# EAGLE design B12356-04b (EAGLE 6.6.0)
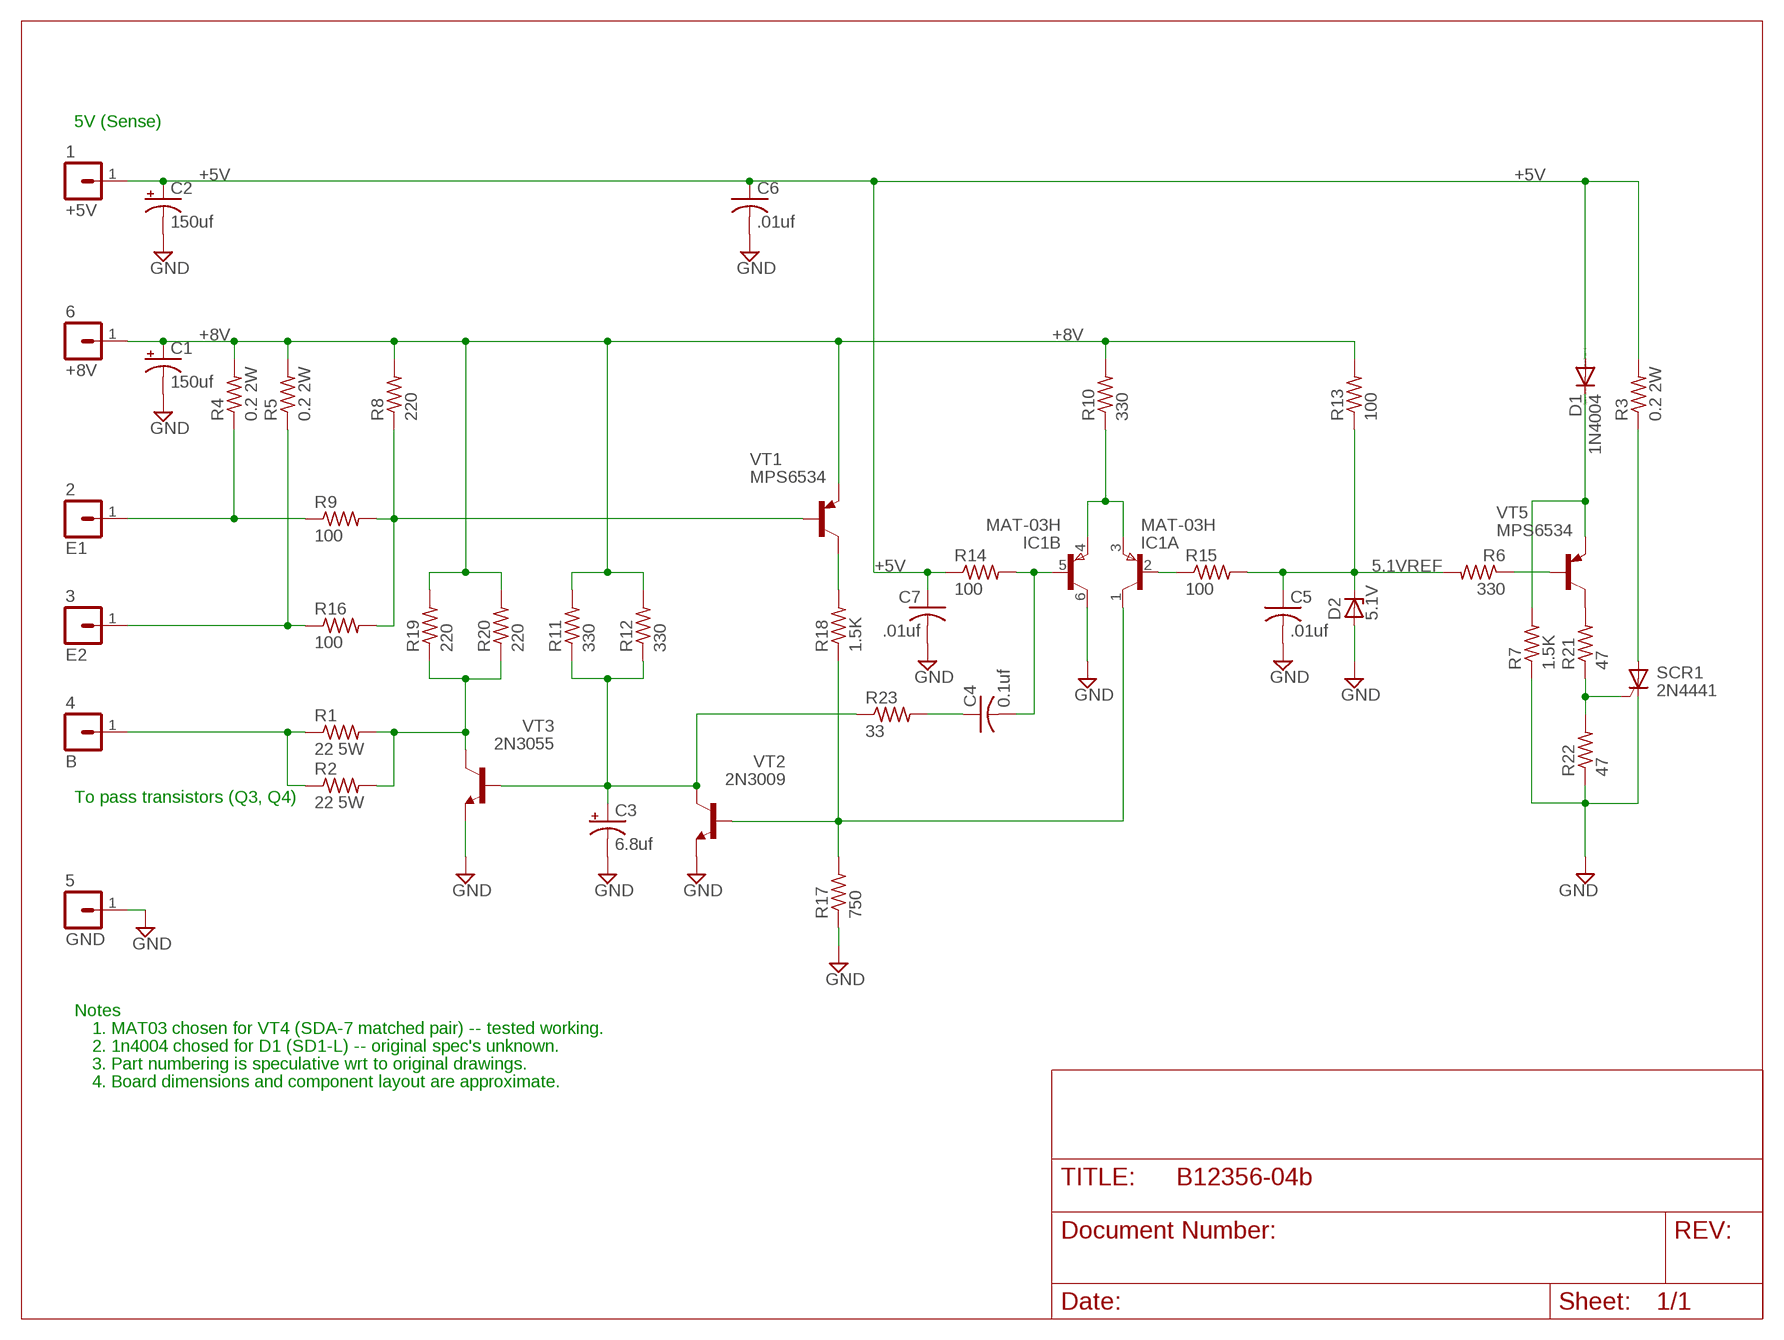
[diagram p0: schematic, sheet 1]

## Parts
+5V  1  LUG  [SPADELUG]
+8V  6  LUG  [SPADELUG]
B  4  LUG  [SPADELUG]
C1  150uf  CPOL-USE30-10AXIAL  [E30-10]
C2  150uf  CPOL-USE25-9AXIAL  [E25-9]
C3  6.8uf  CPOL-USE22-6AXIAL  [E22-6]
C4  0.1uf  C-US150-054X183  [C150-054X183]
C5  .01uf  C-US050-025X075  [C050-025X075]
C6  .01uf  C-US050-025X075  [C050-025X075]
C7  .01uf  C-US050-025X075  [C050-025X075]
D1  1N4004  [DO41-10]
D2  5.1V  ZENER-DIODEF126-12  [F126Z12]
E1  2  LUG  [SPADELUG]
E2  3  LUG  [SPADELUG]
GND  5  LUG  [SPADELUG]
IC1  MAT-03H  [TO78]
R1  22 5W  R-US_0817/22  [P0817/22]
R2  22 5W  R-US_0817/22  [P0817/22]
R3  0.2 2W  R-US_0617/22  [0617/22]
R4  0.2 2W  R-US_0617/22  [0617/22]
R5  0.2 2W  R-US_0617/22  [0617/22]
R6  330  R-US_0207/12  [0207/12]
R7  1.5K  R-US_0207/12  [0207/12]
R8  220  R-US_0207/12  [0207/12]
R9  100  R-US_0207/12  [0207/12]
R10  330  R-US_0207/12  [0207/12]
R11  330  R-US_0207/12  [0207/12]
R12  330  R-US_0207/12  [0207/12]
R13  100  R-US_0207/12  [0207/12]
R14  100  R-US_0207/12  [0207/12]
R15  100  R-US_0207/12  [0207/12]
R16  100  R-US_0207/12  [0207/12]
R17  750  R-US_0207/10  [0207/10]
R18  1.5K  R-US_0207/10  [0207/10]
R19  220  R-US_0207/12  [0207/12]
R20  220  R-US_0207/12  [0207/12]
R21  47  R-US_0207/12  [0207/12]
R22  47  R-US_0207/12  [0207/12]
R23  33  R-US_0207/12  [0207/12]
SCR1  2N4441  BT151  [TO220CL]
VT1  MPS6534  MPSA56-PNP-TO92-BCE  [TO92-BCE]
VT2  2N3009  2N2222  [TO18]
VT3  2N3055  [TO3]
VT5  MPS6534  MPSA56-PNP-TO92-BCE  [TO92-BCE]

## Nets
5.1VREF: C5.1 D2.C R6.2 R13.1 R15.2
+5V: +5V.1 C2.+ C6.1 C7.1 D1.A R3.2 R14.1
+8V: +8V.1 C1.+ R4.2 R5.2 R8.2 R10.2 R11.2 R12.2 R13.2 R19.2 R20.2 VT1.E
GND: C1.- C2.- C3.- C5.2 C6.2 C7.2 D2.A GND.1 IC1.6(B:C) R7.1 R17.1 R22.1 SCR1.C VT2.1(E) VT3.E
N$1: IC1.2(A:B) R15.1
N$2: IC1.3(A:E) IC1.4(B:E) R10.1
N$3: R3.1 SCR1.A
N$4: R21.1 R22.2 SCR1.G
N$5: E1.1 R4.1 R9.1
N$6: E2.1 R5.1 R16.1
N$7: R8.1 R9.2 R16.2 VT1.B
N$8: R21.2 VT5.C
N$9: D1.C R7.2 VT5.E
N$10: R6.1 VT5.B
N$11: IC1.1(A:C) R17.2 R18.1 VT2.2(B)
N$12: B.1 R1.1 R2.1
N$13: R18.2 VT1.C
N$14: C3.+ R11.1 R12.1 R23.1 VT2.3(C) VT3.B
N$16: R1.2 R2.2 R19.1 R20.1 VT3.C VT3.C/(C)
N$18: C4.2 IC1.5(B:B) R14.2
N$19: C4.1 R23.2

## Notes on the sheet
- 5V (Sense)
- To pass transistors (Q3, Q4)
- Notes
- 1. MAT03 chosen for VT4 (SDA-7 matched pair) -- tested working.
- 2. 1n4004 chosed for D1 (SD1-L) -- original spec's unknown.
- 3. Part numbering is speculative wrt to original drawings.
- 4. Board dimensions and component layout are approximate.

## Library data of the parts
+5V +8V B E1 E2 GND = dec-con:LUG: Spade Lug
C1-C3 = rcl:CPOL-US: POLARIZED CAPACITOR, American symbol
C4-C7 = rcl:C-US: CAPACITOR, American symbol
D1 = diode:1N4004: DIODE general purpose rectifier, 1 A
D2 = diode:ZENER-DIODE: Z-Diode
IC1 = linear:MAT-03H: Dual TRANSISTOR
R1-R23 = rcl:R-US_: RESISTOR, American symbol
SCR1 = triac:BT151: THYRISTOR
VT1 VT5 = transistor:*-PNP-: PNP Transistror
VT2 = transistor:2N2222: NPN TRANSISTOR
VT3 = transistor-npn:2N3055: NPN Transistor

## Board
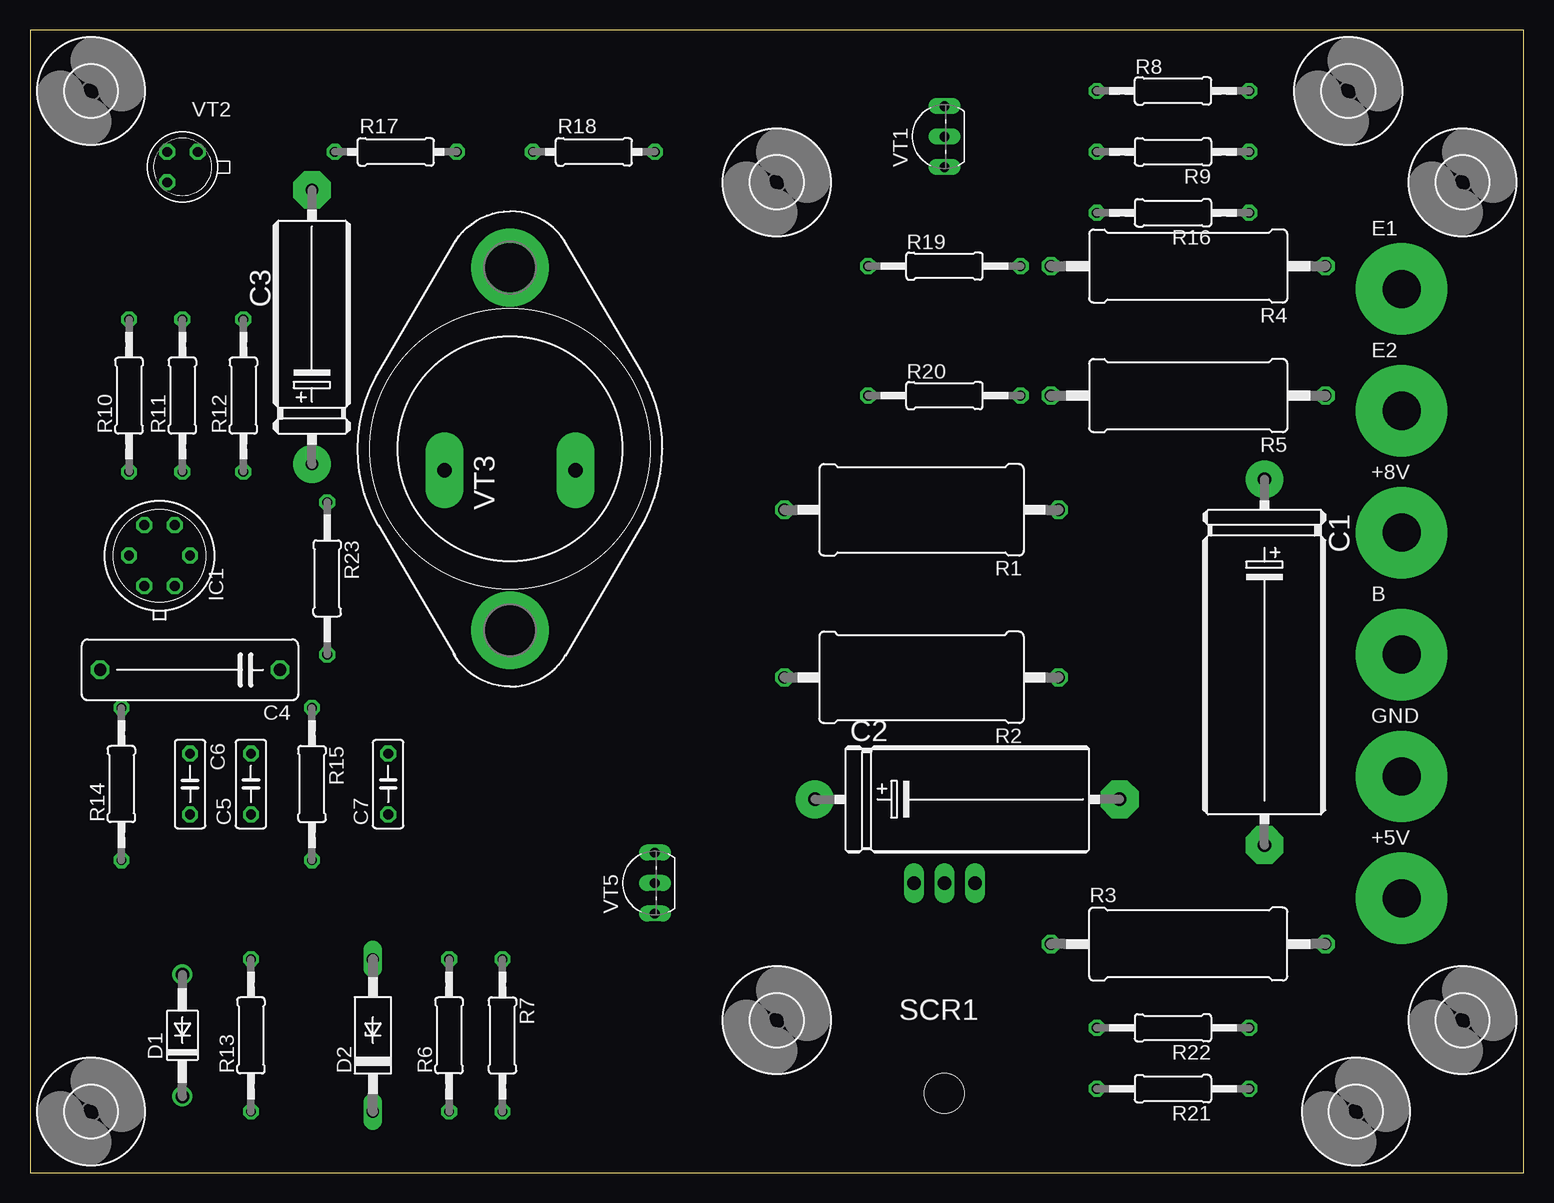
[diagram p1: board, top side]
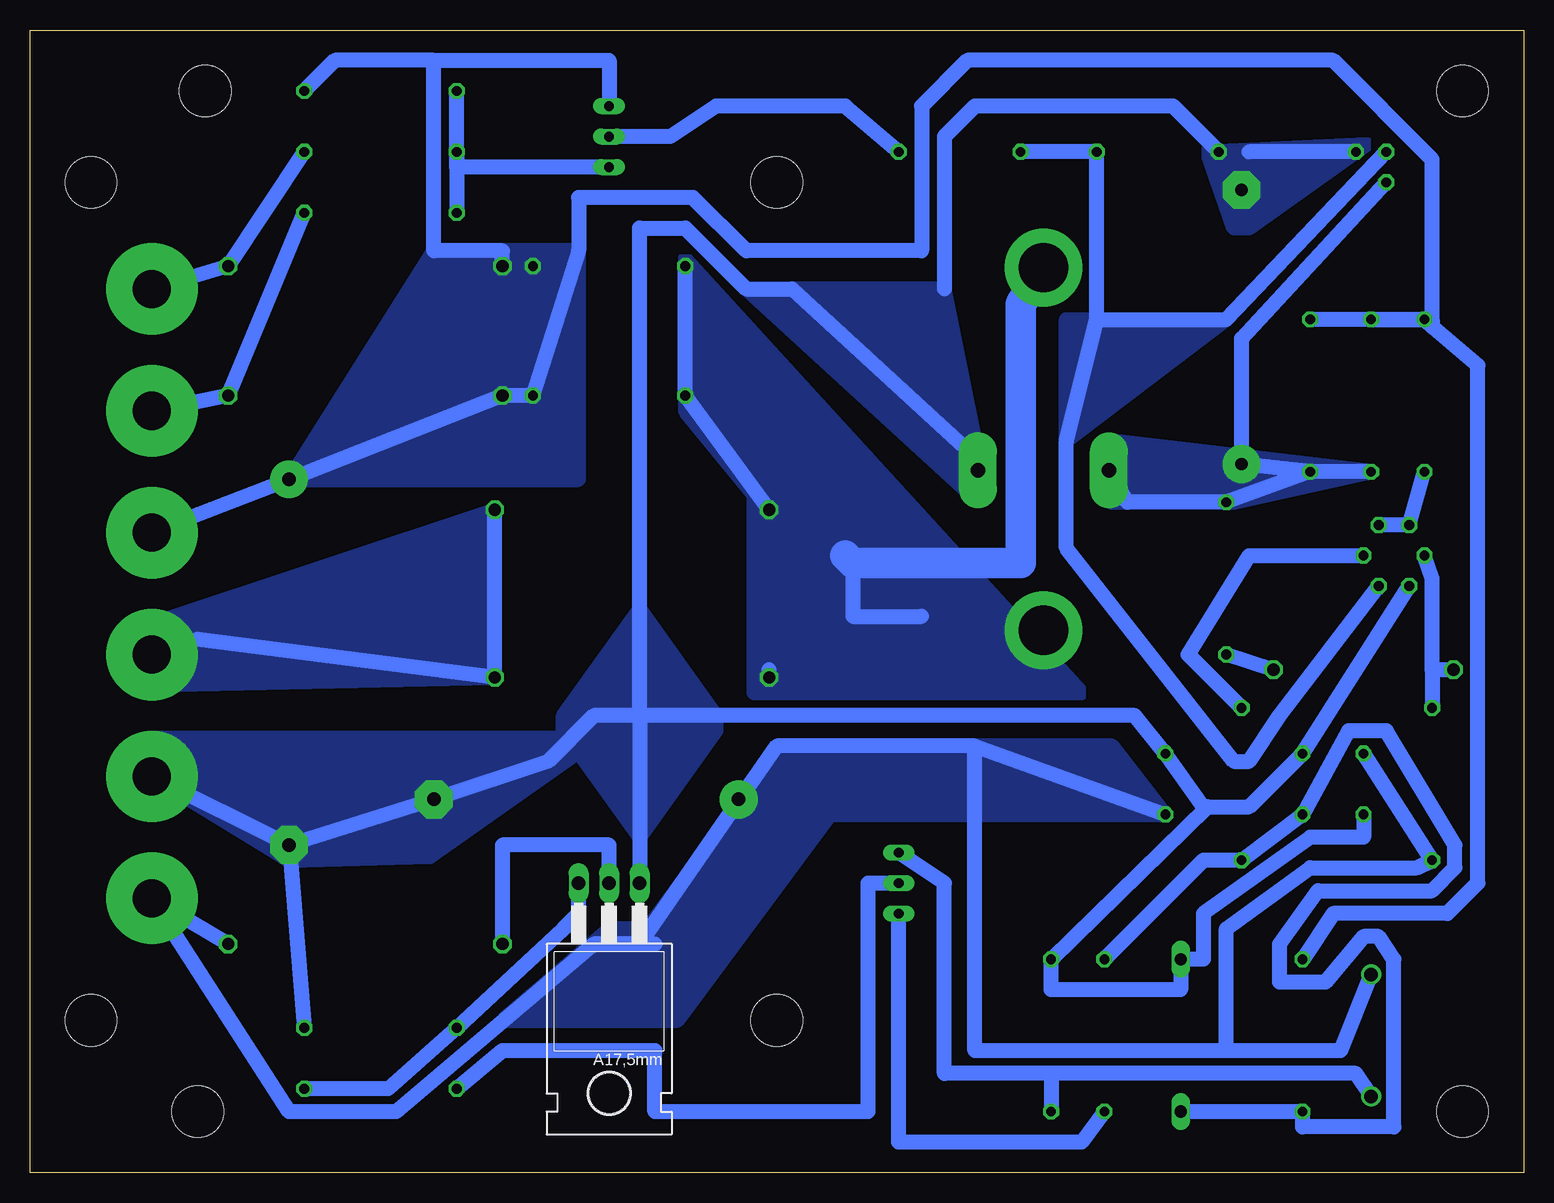
[diagram p2: board, bottom side, seen from below]

Size 124.46 x 95.25 mm. Coordinates in mm from the lower left corner, seen from the top.
Outline: 0,0 124.46,0 124.46,95.25 0,95.25 0,0
Copper layers (1+16): Top 0.035mm / dielectric 1.5mm / Bottom 0.035mm
Design rules "16mils": minimum track width 16mil, minimum drill 32mil, track to track 15mil, track to pad 10mil, pad to pad 10mil, via to via 10mil, smd to smd 10mil, copper to edge 13mil, drill to drill 10mil, minimum pad ring 10mil, minimum via ring 8mil, stop-mask expansion 0mil, vias tented up to drill 0mil, thermal gap 10mil

### Footprints (pad centres in the part's own frame; a part is rotated, then mirrored left to right if it is on the bottom)
SPADELUG = drill 3.175 pad 7.62: 1 0,0
E30-10 = drill 1.118 pad 3.15: + -15.24,0 | drill 1.118 pad 3.15 octagon: - 15.24,0
E25-9 = drill 1.118 pad 3.15: + -12.7,0 | drill 1.118 pad 3.15 octagon: - 12.7,0
E22-6 = drill 1.016 pad 3.15: + -11.43,0 | drill 1.016 pad 3.15 octagon: - 11.43,0
C150-054X183 = drill 1.016 octagon: 1 -7.493,0; 2 7.493,0
C050-025X075 = drill 0.813 octagon: 1 -2.54,0; 2 2.54,0
DO41-10 = drill 1.118: A 5.08,0; C -5.08,0
F126Z12 = drill 1.016 long: A 6.35,0; C -6.35,0
TO78 = drill 0.813 octagon: 1 -2.54,-1.27; 2 0,-2.54; 3 2.54,-1.27; 4 2.54,1.27; 5 0,2.54; 6 -2.54,1.27
P0817/22 = drill 1.016 octagon: 1 -11.43,0; 2 11.43,0
0617/22 = drill 1.016 octagon: 1 -11.43,0; 2 11.43,0
0207/12 = drill 0.813 octagon: 1 -6.35,0; 2 6.35,0
0207/10 = drill 0.813 octagon: 1 -5.08,0; 2 5.08,0
TO220CL = drill 1.118 long: A 0,-6.35; C -2.54,-6.35; G 2.54,-6.35 | hole 3.302: 0,11.176
4,3 = hole 4.3: 0,0
TO92-BCE = drill 0.813 long: B -2.54,0; C 0,0; E 2.54,0
TO18 = drill 0.813 octagon: 1 -1.27,-1.27; 2 1.27,-1.27; 3 1.27,1.27
TO3 = drill 1.194 pad 3.15 long: B -1.778,5.461; E -1.778,-5.461 | drill 4.115 pad 6.477: C 15.113,0; C/ -15.113,0

### Placement (x,y rotation side)
+5V  114.3,22.86 0 top
+8V  114.3,53.34 0 top
B  114.3,43.18 0 top
C1  102.87,42.55 270 top
C2  78.11,31.11 0 top
C3  23.5,70.48 90 top
C4  13.34,41.91 180 top
C5  18.41,32.38 90 top
C6  13.34,32.38 270 top
C7  29.84,32.38 90 top
D1  12.7,11.43 90 top
D2  28.57,11.43 90 top
E1  114.3,73.66 0 top
E2  114.3,63.5 0 top
GND  114.3,33.02 0 top
IC1  10.79,51.44 90 top
R1  74.3,55.24 180 top
R2  74.3,41.27 180 top
R3  96.52,19.05 0 top
R4  96.52,75.56 180 top
R5  96.52,64.77 180 top
R6  34.92,11.43 90 top
R7  39.37,11.43 270 top
R8  95.25,90.17 0 top
R9  95.25,85.09 180 top
R10  8.26,64.77 90 top
R11  12.7,64.77 90 top
R12  17.78,64.77 90 top
R13  18.41,11.43 90 top
R14  7.62,32.38 90 top
R15  23.5,32.38 270 top
R16  95.25,80.01 180 top
R17  30.48,85.09 0 top
R18  46.99,85.09 0 top
R19  76.2,75.56 0 top
R20  76.2,64.77 0 top
R21  95.25,6.99 180 top
R22  95.25,12.06 180 top
R23  24.77,49.53 270 top
SCR1  76.2,17.78 180 bottom
U$1  [4,3]  5.08,90.17 0 top
U$2  [4,3]  5.08,5.08 0 top
U$3  [4,3]  62.23,82.55 0 top
U$4  [4,3]  119.38,82.55 0 top
U$5  [4,3]  109.86,90.17 0 top
U$6  [4,3]  110.49,5.08 0 top
U$7  [4,3]  119.38,12.7 0 top
U$8  [4,3]  62.23,12.7 0 top
VT1  76.2,86.36 90 top
VT2  12.7,83.82 180 top
VT3  40.01,60.33 90 top
VT5  52.07,24.13 90 top

### Tracks (layer width: path | path; a pad name or v marks a point on that pad's centre or on a via)
5.1VREF
  Bottom 1.27: D2.C R13.1 18.41,3.81 10.79,3.81 10.79,17.78 12.06,19.68 13.34,19.68 16.51,15.88 20.32,15.88 20.32,19.05 17.14,23.5 7.62,23.5 5.71,25.4 5.71,27.3 11.43,36.83 14.61,36.83 C5.1 R15.2 26.67,26.04 R6.2
+5V
  Bottom 1.27: R3.2 +5V.1 102.87,5.08 93.98,5.08 77.47,19.05 73.66,19.05 | 62.23,35.56 C2.+ | 45.72,35.56 62.23,35.56 | 73.66,19.05 72.39,19.05 | 62.23,35.56 73.66,19.05 | D1.A 15.24,10.16 24.77,10.16 | 24.77,10.16 45.72,10.16 45.72,35.56 | C6.1 R14.1 8.89,25.4 17.78,25.4 24.77,20.32 24.77,10.16 | 45.72,35.56 C7.1
  pour Bottom (no thermals): 29.84,29.84 34.29,35.56 62.23,35.56 62.23,29.84
  pour Bottom (no thermals): 85.09,12.7 70.48,12.7 53.98,34.92 62.23,34.92 73.03,20.32 76.2,20.32
+8V
  Bottom 1.27: +8V.1 C1.+ R5.2 R20.2 78.74,76.83 78.74,81.28 69.22,81.28 64.77,76.83 50.16,76.83 50.16,88.9 46.35,92.71 15.88,92.71 7.62,84.45 7.62,71.12 | 90.81,92.71 76.2,92.71 VT1.E | 90.81,92.71 99.06,92.71 R8.2 | R11.2 R12.2 | R4.2 85.09,76.83 90.81,76.83 90.81,92.71 | R11.2 7.62,71.12 | 7.62,71.12 7.62,70.48 | R11.2 R10.2 3.81,67.31 3.81,24.13 6.35,21.59 15.88,21.59 R13.2
  pour Bottom (no thermals): 78.74,76.83 90.81,76.83 102.87,57.78 78.74,57.78
GND
  Bottom 1.27: C1.- C2.- 81.28,34.29 77.47,38.1 73.66,38.1 | C1.- GND.1 | 73.66,38.1 73.66,78.74 69.85,78.74 64.77,73.66 60.96,73.66 45.09,59.05 VT3.E | 73.66,38.1 32.38,38.1 C7.2 26.67,30.48 26.35,30.48 | C1.- R22.1 | 73.66,38.1 SCR1.C | R17.1 29.21,88.9 45.72,88.9 48.26,86.36 48.26,73.66 | 26.35,30.48 R7.1 39.37,15.24 28.57,15.24 D2.A 26.67,17.78 26.67,21.59 17.78,27.94 13.34,27.94 C6.2 | 26.35,30.48 22.86,30.48 C5.2 IC1.6 | VT2.1 22.86,85.09
  pour Bottom (no thermals): 45.09,57.78 48.26,73.66 64.77,73.66 45.72,56.2
  pour Bottom (no thermals): 13.03,85.72 22.86,78.74 24.13,78.74 26.37,85.09
  pour Bottom (no thermals): 73.66,46.99 67.31,38.1 67.31,36.83 73.66,27.94 80.01,36.83 80.01,38.1
  pour Bottom (no thermals): 77.15,36.2 114.3,36.2 114.3,33.02 102.87,26.04 91.12,26.35
N$1
  Bottom 1.27: R15.1 27.94,43.18 22.86,51.44 IC1.2
N$2
  Bottom 1.27: IC1.3 IC1.4 R10.1
N$3
  Bottom 1.27: R3.1 85.09,27.3 76.2,27.3 SCR1.A
N$4
  Bottom 1.27: R21.1 94.61,6.99 R22.2 80.01,20.32 78.74,21.59 SCR1.G
N$5
  Bottom 1.27: R4.1 R9.1 | R4.1 E1.1 R4.1
N$6
  Bottom 1.27: E2.1 R5.1 R16.1
N$7
  Bottom 1.27: VT1.B 88.9,83.82 R9.2 | R9.2 R8.1 | R9.2 R16.2
N$8
  Bottom 1.27: R21.2 85.09,10.16 72.39,10.16 72.39,5.08 54.61,5.08 54.61,24.13 VT5.C
N$9
  Bottom 1.27: 39.37,8.26 R7.2 | 39.37,8.26 48.26,8.26 48.26,24.13 VT5.E | D1.C 13.97,8.26 39.37,8.26
N$10
  Bottom 1.27: R6.1 36.83,2.54 52.07,2.54 VT5.B
N$11
  Bottom 1.27: R18.1 R17.2 35.56,71.12 | 35.56,71.12 38.1,60.96 38.1,52.07 24.13,34.29 22.86,34.29 20.32,38.1 IC1.1 | VT2.2 24.77,71.12 35.56,71.12
  pour Bottom (no thermals): 24.77,71.12 38.1,60.96 38.1,71.12
N$12
  Bottom 1.27: R1.1 R2.1 110.49,44.45 B.1
  pour Bottom (no thermals): 85.72,41.27 85.72,55.24 114.3,45.72 114.3,40.64
N$13
  Bottom 1.27: R18.2 56.52,88.9 67.31,88.9 71.12,86.36 VT1.C
N$14
  Bottom 1.27: R11.1 R12.1 | R12.1 C3.+ 23.5,69.53 VT2.3 | VT3.B 33.02,55.88 R23.1 R12.1
  pour Bottom (no thermals): 34.29,55.88 24.13,55.88 12.7,58.42 34.29,60.96
N$16
  Bottom 1.27: R19.1 R20.1 R1.2 | R2.2 62.87,41.91 | 55.88,50.8 55.88,46.35 50.16,46.35
  Bottom 2.54: 56.52,51.44 55.88,50.8 41.91,50.8 41.91,72.39 VT3.C
  pour Bottom (no thermals): 36.83,40.01 69.85,76.2 69.85,63.5 64.14,56.52 64.14,40.01
N$18
  Bottom 1.27: 7.62,41.91 R14.2 | C4.2 7.62,41.91 | IC1.5 7.62,49.53 7.62,41.91
N$19
  Bottom 1.27: C4.1 R23.2

### Text on the board
tValues: Assy No B12356-04 | VRS
200bmp: C:/Users/Vince/Desktop/comp_comment.bmp